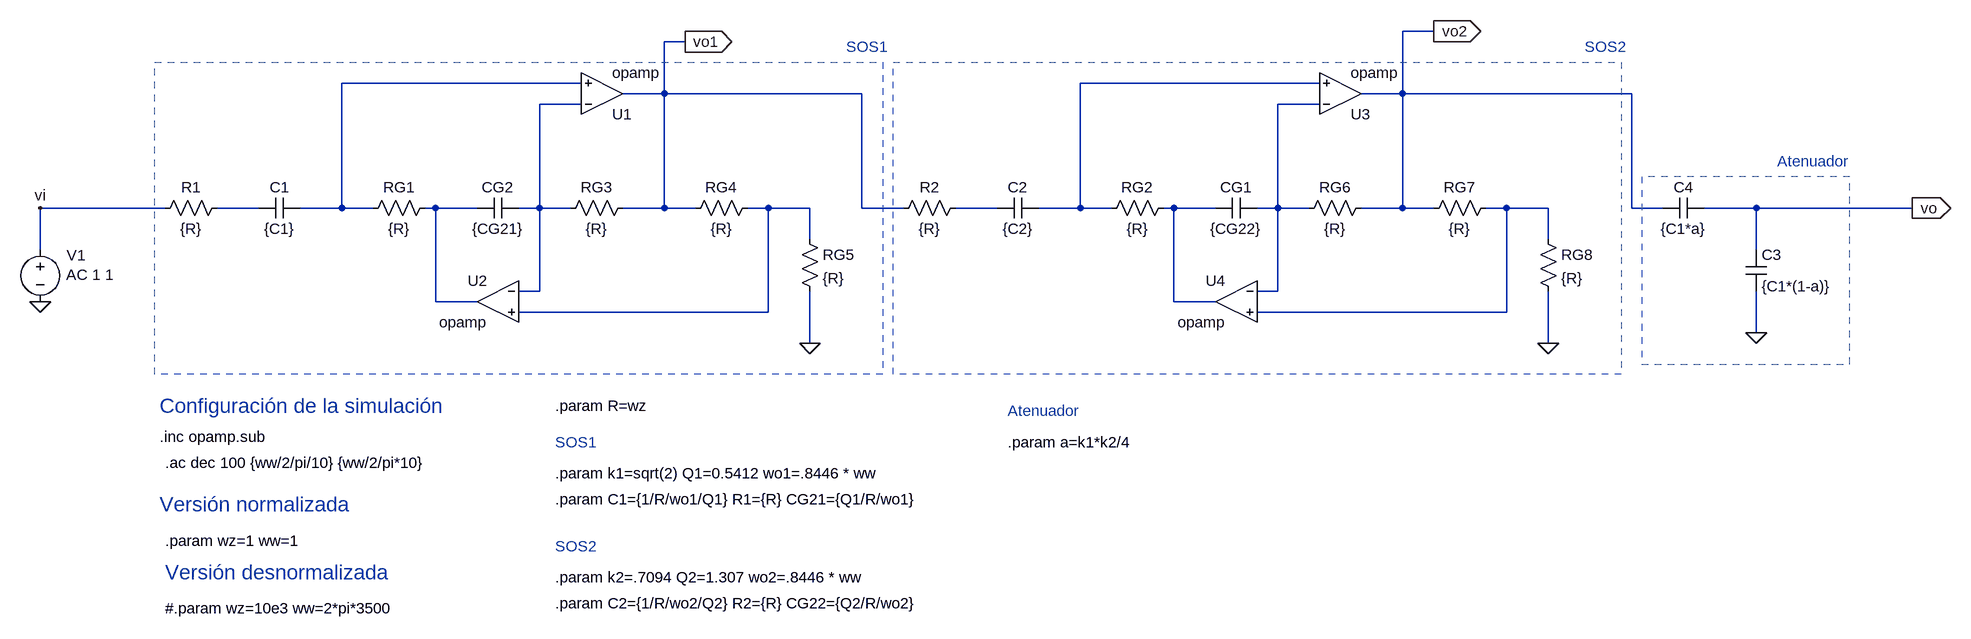
[diagram p0: schematic GIC pasaaltos tp2 ej4.asc]
GIC pasaaltos tp2 ej4.asc, the LTspice schematic file:
Version 4
SHEET 1 2616 808
WIRE 1792 -96 1744 -96
WIRE 640 -80 608 -80
WIRE 480 -16 112 -16
WIRE 1616 -16 1248 -16
WIRE 608 0 608 -80
WIRE 608 0 544 0
WIRE 912 0 608 0
WIRE 1744 0 1744 -96
WIRE 1744 0 1680 0
WIRE 2096 0 1744 0
WIRE 480 16 416 16
WIRE 1616 16 1552 16
WIRE -160 176 -352 176
WIRE -16 176 -80 176
WIRE 112 176 112 -16
WIRE 112 176 48 176
WIRE 160 176 112 176
WIRE 256 176 240 176
WIRE 320 176 256 176
WIRE 416 176 416 16
WIRE 416 176 384 176
WIRE 464 176 416 176
WIRE 608 176 608 0
WIRE 608 176 544 176
WIRE 656 176 608 176
WIRE 768 176 736 176
WIRE 832 176 768 176
WIRE 912 176 912 0
WIRE 976 176 912 176
WIRE 1120 176 1056 176
WIRE 1248 176 1248 -16
WIRE 1248 176 1184 176
WIRE 1296 176 1248 176
WIRE 1392 176 1376 176
WIRE 1456 176 1392 176
WIRE 1552 176 1552 16
WIRE 1552 176 1520 176
WIRE 1600 176 1552 176
WIRE 1744 176 1744 0
WIRE 1744 176 1680 176
WIRE 1792 176 1744 176
WIRE 1904 176 1872 176
WIRE 1968 176 1904 176
WIRE 2096 176 2096 0
WIRE 2144 176 2096 176
WIRE 2288 176 2208 176
WIRE 2528 176 2288 176
WIRE 832 224 832 176
WIRE 1968 224 1968 176
WIRE -352 240 -352 176
WIRE 2288 240 2288 176
WIRE 416 304 416 176
WIRE 416 304 384 304
WIRE 1552 304 1552 176
WIRE 1552 304 1520 304
WIRE 256 320 256 176
WIRE 320 320 256 320
WIRE 1392 320 1392 176
WIRE 1456 320 1392 320
WIRE 768 336 768 176
WIRE 768 336 384 336
WIRE 1904 336 1904 176
WIRE 1904 336 1520 336
WIRE 2288 368 2288 304
WIRE 832 384 832 304
WIRE 1968 384 1968 304
FLAG 832 384 0
FLAG -352 320 0
FLAG -352 176 vi
FLAG 1968 384 0
FLAG 2528 176 vo
IOPIN 2528 176 Out
FLAG 2288 368 0
FLAG 640 -80 vo1
IOPIN 640 -80 Out
FLAG 1792 -96 vo2
IOPIN 1792 -96 Out
SYMBOL res -64 160 R90
WINDOW 0 0 56 VBottom 2
WINDOW 3 32 56 VTop 2
SYMATTR InstName R1
SYMATTR Value {R}
SYMBOL res 144 192 R270
WINDOW 0 32 56 VTop 2
WINDOW 3 0 56 VBottom 2
SYMATTR InstName RG1
SYMATTR Value {R}
SYMBOL res 448 192 R270
WINDOW 0 32 56 VTop 2
WINDOW 3 0 56 VBottom 2
SYMATTR InstName RG3
SYMATTR Value {R}
SYMBOL res 640 192 R270
WINDOW 0 32 56 VTop 2
WINDOW 3 0 56 VBottom 2
SYMATTR InstName RG4
SYMATTR Value {R}
SYMBOL res 816 208 R0
SYMATTR InstName RG5
SYMATTR Value {R}
SYMBOL cap -16 192 R270
WINDOW 0 32 32 VTop 2
WINDOW 3 0 32 VBottom 2
SYMATTR InstName C1
SYMATTR Value {C1}
SYMBOL cap 320 192 R270
WINDOW 0 32 32 VTop 2
WINDOW 3 0 32 VBottom 2
SYMATTR InstName CG2
SYMATTR Value {CG21}
SYMBOL OpAmps\\opamp 512 64 M180
SYMATTR InstName U1
SYMBOL OpAmps\\opamp 352 256 M0
SYMATTR InstName U2
SYMBOL voltage -352 224 R0
WINDOW 123 40 55 Left 2
WINDOW 39 0 0 Left 0
WINDOW 0 41 25 Left 2
SYMATTR Value2 AC 1 1
SYMATTR InstName V1
SYMATTR Value ""
SYMBOL res 1072 160 R90
WINDOW 0 0 56 VBottom 2
WINDOW 3 32 56 VTop 2
SYMATTR InstName R2
SYMATTR Value {R}
SYMBOL res 1280 192 R270
WINDOW 0 32 56 VTop 2
WINDOW 3 0 56 VBottom 2
SYMATTR InstName RG2
SYMATTR Value {R}
SYMBOL res 1584 192 R270
WINDOW 0 32 56 VTop 2
WINDOW 3 0 56 VBottom 2
SYMATTR InstName RG6
SYMATTR Value {R}
SYMBOL res 1776 192 R270
WINDOW 0 32 56 VTop 2
WINDOW 3 0 56 VBottom 2
SYMATTR InstName RG7
SYMATTR Value {R}
SYMBOL res 1952 208 R0
SYMATTR InstName RG8
SYMATTR Value {R}
SYMBOL cap 1120 192 R270
WINDOW 0 32 32 VTop 2
WINDOW 3 0 32 VBottom 2
SYMATTR InstName C2
SYMATTR Value {C2}
SYMBOL cap 1456 192 R270
WINDOW 0 32 32 VTop 2
WINDOW 3 0 32 VBottom 2
SYMATTR InstName CG1
SYMATTR Value {CG22}
SYMBOL OpAmps\\opamp 1648 64 M180
SYMATTR InstName U3
SYMBOL OpAmps\\opamp 1488 256 M0
SYMATTR InstName U4
SYMBOL cap 2272 240 R0
SYMATTR InstName C3
SYMATTR Value {C1*(1-a)}
SYMBOL cap 2208 160 R90
WINDOW 0 0 32 VBottom 2
WINDOW 3 32 32 VTop 2
SYMATTR InstName C4
SYMATTR Value {C1*a}
TEXT -168 528 Left 2 !.inc opamp.sub
TEXT -160 568 Left 2 !.ac dec 100 {ww/2/pi/10} {ww/2/pi*10}
TEXT 440 584 Left 2 !.param k1=sqrt(2) Q1=0.5412 wo1=.8446 * ww
TEXT -160 792 Left 2 !#.param wz=10e3 ww=2*pi*3500
TEXT -168 632 Left 3 ;Versión normalizada
TEXT -160 736 Left 3 ;Versión desnormalizada
TEXT 440 624 Left 2 !.param C1={1/R/wo1/Q1} R1={R} CG21={Q1/R/wo1}
TEXT -160 688 Left 2 !.param wz=1 ww=1
TEXT 440 536 Left 2 ;SOS1
TEXT 440 784 Left 2 !.param C2={1/R/wo2/Q2} R2={R} CG22={Q2/R/wo2}
TEXT 440 696 Left 2 ;SOS2
TEXT 440 744 Left 2 !.param k2=.7094 Q2=1.307 wo2=.8446 * ww
TEXT 440 480 Left 2 !.param R=wz
TEXT -168 480 Left 3 ;Configuración de la simulación
TEXT 888 -72 Left 2 ;SOS1
TEXT 2024 -72 Left 2 ;SOS2
TEXT 1136 488 Left 2 ;Atenuador
TEXT 1136 536 Left 2 !.param a=k1*k2/4
TEXT 2320 104 Left 2 ;Atenuador
RECTANGLE Normal 944 432 -176 -48 2
RECTANGLE Normal 2080 432 960 -48 2
RECTANGLE Normal 2432 128 2112 416 2

The netlist it stands for:
* GIC pasaaltos tp2 ej4.asc
R1 N005 vi {R}
RG1 N001 N006 {R}
RG3 N003 vo1 {R}
RG4 vo1 N007 {R}
RG5 N007 0 {R}
C1 N005 N001 {C1}
CG2 N006 N003 {CG21}
XU1 N003 N001 vo1 opamp Aol=100K GBW=10Meg  ; pins invin noninvin out
XU2 N003 N007 N006 opamp Aol=100K GBW=10Meg  ; pins invin noninvin out
V1 vi 0 AC 1 1
R2 N008 vo1 {R}
RG2 N002 N009 {R}
RG6 N004 vo2 {R}
RG7 vo2 N010 {R}
RG8 N010 0 {R}
C2 N008 N002 {C2}
CG1 N009 N004 {CG22}
XU3 N004 N002 vo2 opamp Aol=100K GBW=10Meg  ; pins invin noninvin out
XU4 N004 N010 N009 opamp Aol=100K GBW=10Meg  ; pins invin noninvin out
C3 vo 0 {C1*(1-a)}
C4 vo vo2 {C1*a}
.inc opamp.sub
.ac dec 100 {ww/2/pi/10} {ww/2/pi*10}
.param k1=sqrt(2) Q1=0.5412 wo1=.8446 * ww
#.param wz=10e3 ww=2*pi*3500
* Versión normalizada
* Versión desnormalizada
.param C1={1/R/wo1/Q1} R1={R} CG21={Q1/R/wo1}
.param wz=1 ww=1
* SOS1
.param C2={1/R/wo2/Q2} R2={R} CG22={Q2/R/wo2}
* SOS2
.param k2=.7094 Q2=1.307 wo2=.8446 * ww
.param R=wz
* Configuración de la simulación
* SOS1
* SOS2
* Atenuador
.param a=k1*k2/4
* Atenuador
.backanno
.end